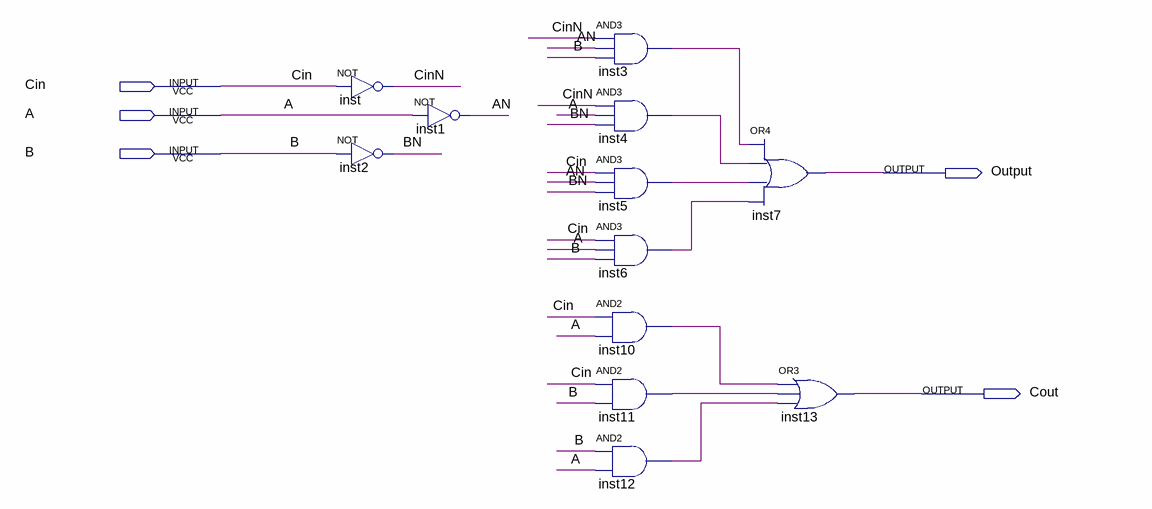
[diagram p0: schematic sheet]
// Quartus schematic Lab3.bdf as structural Verilog: 12 symbols, 5 pins
module Lab3 (
  input  Cin,
  input  A,
  input  B,
  output Output,
  output Cout
);

  wire AN, BN, CinN, inst3_out, inst4_out, inst5_out, inst6_out, inst10_out, inst11_out, inst12_out;

  not inst (CinN, Cin);
  not inst2 (BN, B);
  not inst1 (AN, A);
  and inst3 (inst3_out, CinN, AN, B);
  and inst4 (inst4_out, CinN, A, BN);
  and inst5 (inst5_out, Cin, AN, BN);
  and inst6 (inst6_out, Cin, A, B);
  and inst10 (inst10_out, Cin, A);
  and inst11 (inst11_out, Cin, B);
  and inst12 (inst12_out, B, A);
  or inst7 (Output, inst3_out, inst4_out, inst5_out, inst6_out);
  or inst13 (Cout, inst10_out, inst11_out, inst12_out);
endmodule
